# Altium schematic sheet Microcontroller.SchDoc
size A3; SheetNumber: 13; SheetTotal: 16
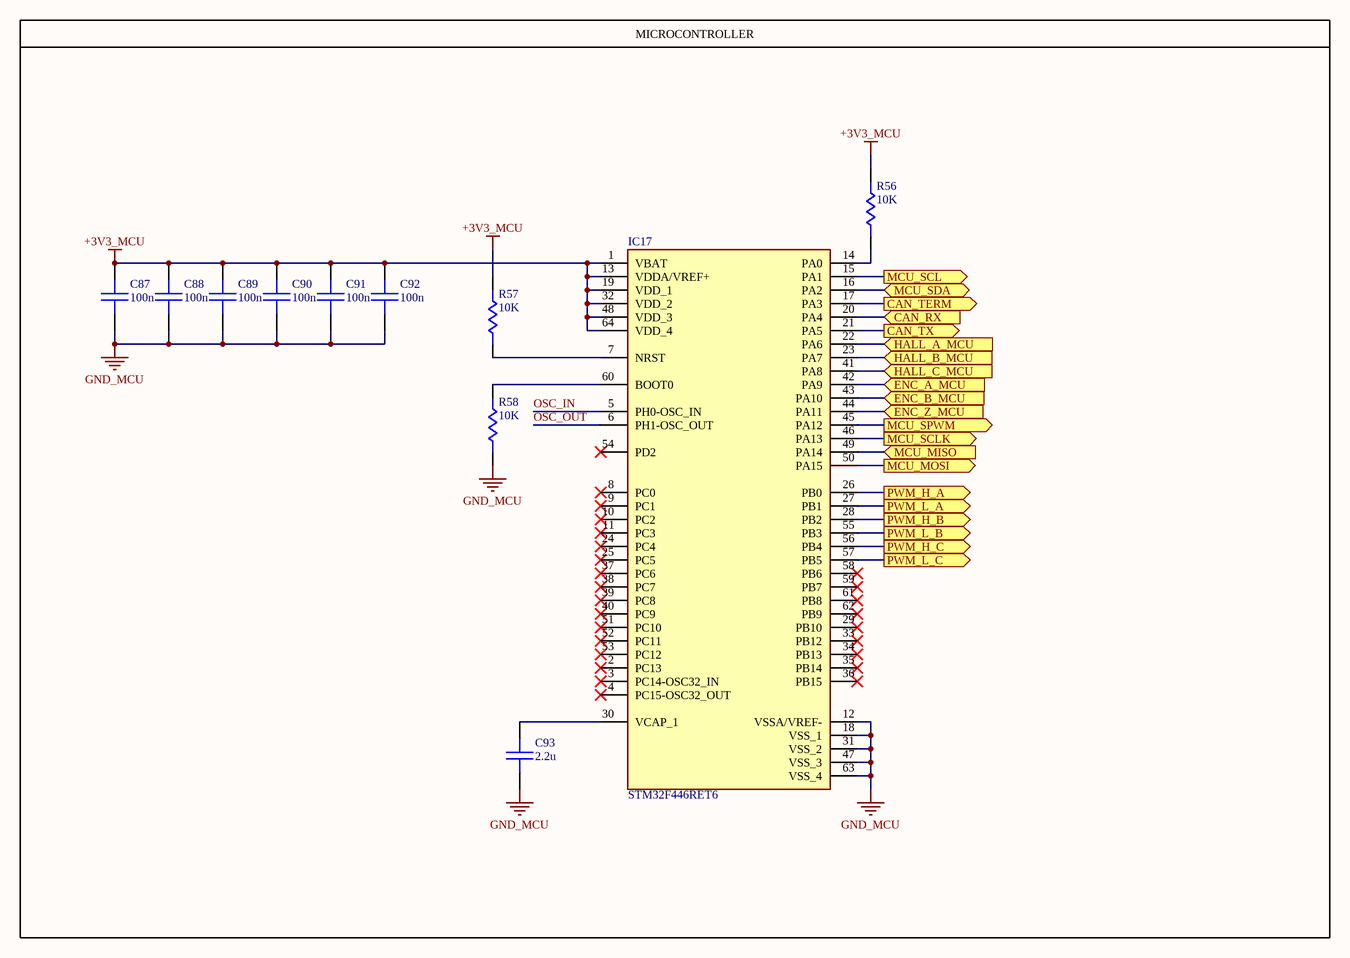
[diagram p0: Microcontroller.SchDoc]

## Parts
C87  100n  [C_0603]
C88  100n  [C_0603]
C89  100n  [C_0603]
C90  100n  [C_0603]
C91  100n  [C_0603]
C92  100n  [C_0603]
C93  2.2u  [C_0603]
IC17  STM32F446RET6  [QFP50P1200X1200X160-64N]
R56  10K  [R_0603]
R57  10K  [R_0603]
R58  10K  [R_0603]

## Blocks framed on the sheet
MICROCONTROLLER: C87-C93 IC17 R56-R58

## Ports
CAN_RX (in, see Interconnections[5B], Communications[1A]), CAN_TERM (out, see Interconnections[5B], Communications[1B]), CAN_TX (out, see Interconnections[5B], Communications[1A]), ENC_A_MCU (in, see Interconnections[5B], Feedback_Sensors[7B]), ENC_B_MCU (in, see Interconnections[5B], Feedback_Sensors[7B]), ENC_Z_MCU (in, see Interconnections[5B], Feedback_Sensors[7B]), HALL_A_MCU (in, see Interconnections[5B], Feedback_Sensors[7A]), HALL_B_MCU (in, see Interconnections[5B], Feedback_Sensors[7A]), HALL_C_MCU (in, see Interconnections[5B], Feedback_Sensors[7A]), MCU_MISO (in, see Interconnections[5C], Isolator_Spi[1A]), MCU_MOSI (out, see Interconnections[5C], Isolator_Spi[1A]), MCU_SCL (out, see Interconnections[5A], Isolator_I2C[1A]), MCU_SCLK (out, see Interconnections[5C], Isolator_Spi[1A]), MCU_SDA (bidir, see Interconnections[5A], Isolator_I2C[1A]), MCU_SPWM (out, see Interconnections[5B], Isolator_SPWM[1A]), PWM_H_A (out, see Interconnections[5C], Isolator_Gate_Driver[1A]), PWM_H_B (out, see Interconnections[5C], Isolator_Gate_Driver[1A]), PWM_H_C (out, see Interconnections[5C], Isolator_Gate_Driver[1A]), PWM_L_A (out, see Interconnections[5C], Isolator_Gate_Driver[1A]), PWM_L_B (out, see Interconnections[5C], Isolator_Gate_Driver[1A]), PWM_L_C (out, see Interconnections[5C], Isolator_Gate_Driver[1A])

## Nets
+3V3_MCU: C87.2 C88.2 C89.2 C90.2 C91.2 C92.2 IC17.1(VBAT) IC17.13(VDDA/VREF+) IC17.19(VDD_1) IC17.32(VDD_2) IC17.48(VDD_3) IC17.64(VDD_4) R56.1 R57.1
GND_MCU: C87.1 C88.1 C89.1 C90.1 C91.1 C92.1 C93.1 IC17.12(VSSA/VREF-) IC17.18(VSS_1) IC17.31(VSS_2) IC17.47(VSS_3) IC17.63(VSS_4) R58.2
CAN_RX: IC17.20(PA4) ; port CAN_RX
CAN_TERM: IC17.17(PA3) ; port CAN_TERM
CAN_TX: IC17.21(PA5) ; port CAN_TX
ENC_A_MCU: IC17.42(PA9) ; port ENC_A_MCU
ENC_B_MCU: IC17.43(PA10) ; port ENC_B_MCU
ENC_Z_MCU: IC17.44(PA11) ; port ENC_Z_MCU
HALL_A_MCU: IC17.22(PA6) ; port HALL_A_MCU
HALL_B_MCU: IC17.23(PA7) ; port HALL_B_MCU
HALL_C_MCU: IC17.41(PA8) ; port HALL_C_MCU
MCU_MISO: IC17.49(PA14) ; port MCU_MISO
MCU_MOSI: IC17.50(PA15) ; port MCU_MOSI
MCU_SCL: IC17.15(PA1) ; port MCU_SCL
MCU_SCLK: IC17.46(PA13) ; port MCU_SCLK
MCU_SDA: IC17.16(PA2) ; port MCU_SDA
MCU_SPWM: IC17.45(PA12) ; port MCU_SPWM
OSC_IN: IC17.5(PH0-OSC_IN)
OSC_OUT: IC17.6(PH1-OSC_OUT)
PWM_H_A: IC17.26(PB0) ; port PWM_H_A
PWM_H_B: IC17.28(PB2) ; port PWM_H_B
PWM_H_C: IC17.56(PB4) ; port PWM_H_C
PWM_L_A: IC17.27(PB1) ; port PWM_L_A
PWM_L_B: IC17.55(PB3) ; port PWM_L_B
PWM_L_C: IC17.57(PB5) ; port PWM_L_C
NetC93_2: C93.2 IC17.30(VCAP_1)
NetIC17_7: IC17.7(NRST) R57.2
NetIC17_14: IC17.14(PA0) R56.2
NetIC17_60: IC17.60(BOOT0) R58.1

Not connected (* = marked no-connect by the designer): IC17 2(PC13)* 3(PC14-OSC32_IN)* 4(PC15-OSC32_OUT)* 8(PC0)* 9(PC1)* 10(PC2)* 11(PC3)* 24(PC4)* 25(PC5)* 29(PB10)* 33(PB12)* 34(PB13)* 35(PB14)* 36(PB15)* 37(PC6)* 38(PC7)* 39(PC8)* 40(PC9)* 51(PC10)* 52(PC11)* 53(PC12)* 54(PD2)* 58(PB6)* 59(PB7)* 61(PB8)* 62(PB9)*

## Library data of the parts
C87-C93 = CAP: SMD Chip Capacitor
IC17 = STM32F446RET6: Integrated Circuit; Manufacturer_Name: STMicroelectronics; Datasheet Link: https://datasheet.datasheetarchive.com/originals/distributors/DKDS41/DSANUWW0028583.pdf; Height: 1.6mm; Manufacturer_Part_Number: STM32F446RET6; Mouser Part Number: 511-STM32F446RET6; Mouser Price/Stock: https://www.mouser.co.uk/ProductDetail/STMicroelectronics/STM32F446RET6?qs=Ok1pvOkw6%2FqpQsWf8F4wtQ%3D%3D; Arrow Part Number: STM32F446RET6; Arrow Price/Stock: https://www.arrow.com/en/products/stm32f446ret6/stmicroelectronics?utm_currency=USD&region=nac
R56-R58 = RES: SMD Chip Resistor